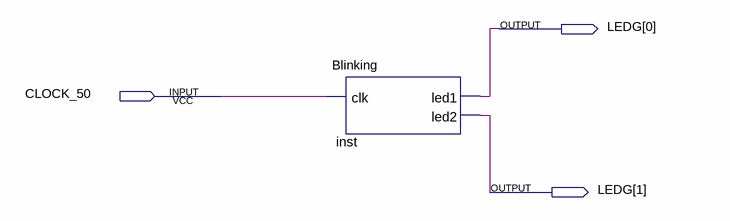
[diagram p0: schematic sheet]
// Quartus schematic teste_blinking.bdf as structural Verilog: 1 symbols, 3 pins
module teste_blinking (
  input  CLOCK_50,
  output [1:0] LEDG
);

  Blinking inst (.clk(CLOCK_50), .led1(LEDG[0]), .led2(LEDG[1]));
endmodule
